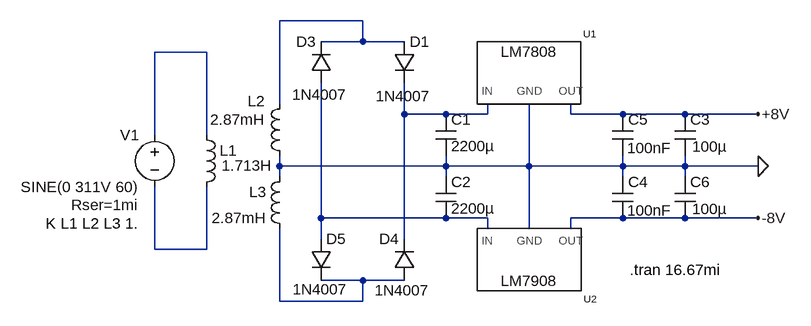
[diagram p0: schematic Simulation-Symmetric-Source.asc]
Simulation-Symmetric-Source.asc, the LTspice schematic file:
Version 4.1
SHEET 1 880 1060
WIRE -352 544 -480 544
WIRE -352 576 -352 544
WIRE -352 576 -416 576
WIRE -288 576 -352 576
WIRE -592 592 -672 592
WIRE -480 672 -480 544
WIRE -288 688 -288 640
WIRE -224 688 -288 688
WIRE -160 688 -160 672
WIRE -160 688 -224 688
WIRE -32 688 -32 672
WIRE 48 688 -32 688
WIRE 144 688 48 688
WIRE 256 688 144 688
WIRE -672 720 -672 592
WIRE -592 720 -592 592
WIRE -480 768 -480 752
WIRE -224 768 -224 752
WIRE -224 768 -480 768
WIRE -96 768 -96 672
WIRE -96 768 -224 768
WIRE 48 768 48 752
WIRE 48 768 -96 768
WIRE 144 768 144 752
WIRE 144 768 48 768
WIRE 256 768 144 768
WIRE -480 784 -480 768
WIRE -224 784 -224 768
WIRE 48 784 48 768
WIRE 144 784 144 768
WIRE -416 848 -416 640
WIRE -224 848 -416 848
WIRE -160 848 -224 848
WIRE 48 848 -32 848
WIRE 144 848 48 848
WIRE 256 848 144 848
WIRE -160 864 -160 848
WIRE -96 864 -96 768
WIRE -32 864 -32 848
WIRE -416 880 -416 848
WIRE -288 880 -288 688
WIRE -672 896 -672 800
WIRE -592 896 -592 800
WIRE -592 896 -672 896
WIRE -352 944 -416 944
WIRE -288 944 -352 944
WIRE -480 976 -480 864
WIRE -352 976 -352 944
WIRE -352 976 -480 976
FLAG 256 688 +8V
FLAG 256 768 0
FLAG 256 848 -8V
SYMBOL voltage -672 704 M0
WINDOW 123 0 0 Left 0
WINDOW 39 24 124 Left 2
SYMATTR SpiceLine Rser=1mi
SYMATTR InstName V1
SYMATTR Value SINE(0 311V 60)
SYMBOL ind -608 704 R0
WINDOW 3 39 63 Left 2
SYMATTR Value 1.713H
SYMATTR InstName L1
SYMATTR Type ind
SYMBOL ind -464 656 M0
WINDOW 0 38 12 Left 2
WINDOW 3 38 40 Left 2
SYMATTR InstName L2
SYMATTR Value 2.87mH
SYMATTR Type ind
SYMBOL ind -464 768 M0
SYMATTR InstName L3
SYMATTR Value 2.87mH
SYMATTR Type ind
SYMBOL diode -304 576 R0
WINDOW 3 -28 84 Left 2
SYMATTR Value 1N4007
SYMATTR InstName D1
SYMBOL diode -400 640 R180
WINDOW 0 24 64 Left 2
WINDOW 3 -24 -18 Left 2
SYMATTR InstName D3
SYMATTR Value 1N4007
SYMBOL diode -272 944 R180
WINDOW 0 24 64 Left 2
WINDOW 3 -23 -15 Left 2
SYMATTR InstName D4
SYMATTR Value 1N4007
SYMBOL diode -432 880 R0
WINDOW 3 -28 78 Left 2
SYMATTR Value 1N4007
SYMATTR InstName D5
SYMBOL Reguladores\\LM7808 -96 640 R0
SYMATTR InstName U1
SYMBOL Reguladores\\LM7908 -96 896 M180
SYMATTR InstName U2
SYMBOL cap 32 784 R0
WINDOW 3 23 52 Left 2
SYMATTR InstName C4
SYMATTR Value 100nF
SYMATTR SpiceLine V=35V
SYMBOL cap 128 784 R0
WINDOW 3 27 50 Left 2
SYMATTR Value 100µ
SYMATTR InstName C6
SYMATTR SpiceLine V=25 Irms=145m Rser=0.62 Lser=0 mfg="Nichicon" pn="UPR1E101MPH" type="Al electrolytic"
SYMBOL cap -240 784 R0
WINDOW 3 24 49 Left 2
SYMATTR Value 2200µ
SYMATTR InstName C2
SYMATTR SpiceLine V=25 Irms=2.39 Rser=0.021 Lser=0 mfg="Panasonic" pn="ECA1EFQ222L" type="Al electrolytic"
SYMBOL cap -240 688 R0
WINDOW 3 24 49 Left 2
SYMATTR Value 2200µ
SYMATTR InstName C1
SYMATTR SpiceLine V=25 Irms=2.39 Rser=0.021 Lser=0 mfg="Panasonic" pn="ECA1EFQ222L" type="Al electrolytic"
SYMBOL cap 128 688 R0
WINDOW 3 27 50 Left 2
SYMATTR Value 100µ
SYMATTR InstName C3
SYMATTR SpiceLine V=25 Irms=145m Rser=0.62 Lser=0 mfg="Nichicon" pn="UPR1E101MPH" type="Al electrolytic"
SYMBOL cap 32 688 R0
WINDOW 3 23 52 Left 2
SYMATTR InstName C5
SYMATTR Value 100nF
SYMATTR SpiceLine V=35V
TEXT 200 928 Right 2 !.tran 16.67mi
TEXT -840 856 Left 2 !K L1 L2 L3 1.

The netlist it stands for:
* Simulation-Symmetric-Source.asc
V1 N002 N005 SINE(0 311V 60) Rser=1mi
L1 N002 N005 1.713H
L2 N001 0 2.87mH
L3 0 N006 2.87mH
D1 N001 N003 1N4007
D3 N004 N001 1N4007
D4 N006 N003 1N4007
D5 N004 N006 1N4007
X§U1 N003 0 +8V LM7808  ; pins IN GND OUT
X§U2 N004 0 -8V LM7908  ; pins IN GND OUT
C4 0 -8V 100nF V=35V
C6 0 -8V 100µ V=25 Irms=145m Rser=0.62 Lser=0 mfg="Nichicon" pn="UPR1E101MPH" type="Al electrolytic"
C2 0 N004 2200µ V=25 Irms=2.39 Rser=0.021 Lser=0 mfg="Panasonic" pn="ECA1EFQ222L" type="Al electrolytic"
C1 N003 0 2200µ V=25 Irms=2.39 Rser=0.021 Lser=0 mfg="Panasonic" pn="ECA1EFQ222L" type="Al electrolytic"
C3 +8V 0 100µ V=25 Irms=145m Rser=0.62 Lser=0 mfg="Nichicon" pn="UPR1E101MPH" type="Al electrolytic"
C5 +8V 0 100nF V=35V
.model D D
.lib standard.dio
.tran 16.67mi
K L1 L2 L3 1.
.lib C:\Users\Acer\repos\ERG-2025\symmetric-source\SPICE-models\LM7808.CIR
.lib C:\Users\Acer\repos\ERG-2025\symmetric-source\SPICE-models\LM7908.CIR
.backanno
.end